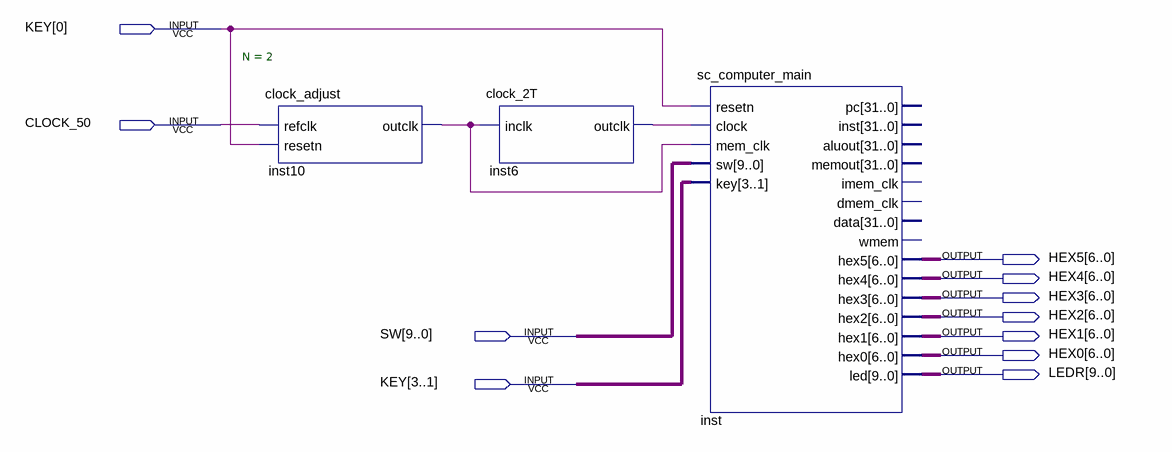
[diagram p0: schematic sheet]
// Quartus schematic sc_computer.bdf as structural Verilog: 3 symbols, 11 pins
module sc_computer (
  input  [3:0] KEY,
  input  CLOCK_50,
  input  [9:0] SW,
  output [6:0] HEX5,
  output [6:0] HEX4,
  output [6:0] HEX3,
  output [6:0] HEX2,
  output [6:0] HEX1,
  output [6:0] HEX0,
  output [9:0] LEDR
);

  wire inst6_outclk, inst10_outclk;

  clock_adjust #(.N(2)) inst10 (.refclk(CLOCK_50), .resetn(KEY[0]), .outclk(inst10_outclk));
  clock_2T inst6 (.inclk(inst10_outclk), .outclk(inst6_outclk));
  sc_computer_main inst (
    .resetn(KEY[0]), .clock(inst6_outclk), .mem_clk(inst10_outclk), .sw(SW), .key(KEY[3:1]), .hex5(HEX5),
    .hex4(HEX4), .hex3(HEX3), .hex2(HEX2), .hex1(HEX1), .hex0(HEX0), .led(LEDR));  // open: pc, inst, aluout, memout, imem_clk, dmem_clk, data, wmem
endmodule
